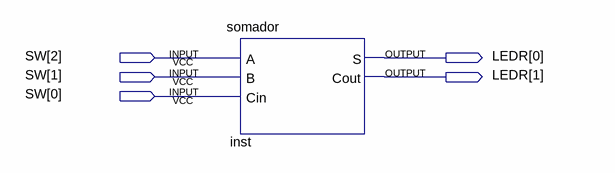
[diagram p0: schematic sheet]
// Quartus schematic Exp6_2.bdf as structural Verilog: 1 symbols, 5 pins
module Exp6_2 (
  input  [2:0] SW,
  output [1:0] LEDR
);

  somador inst (.A(SW[2]), .B(SW[1]), .Cin(SW[0]), .S(LEDR[0]), .Cout(LEDR[1]));
endmodule
